# EAGLE design ads-b (EAGLE 7.5.0)
PROJECT_NAME: ADS-B Receiver; REVISION: 0.1

## Sheet 1 of 2
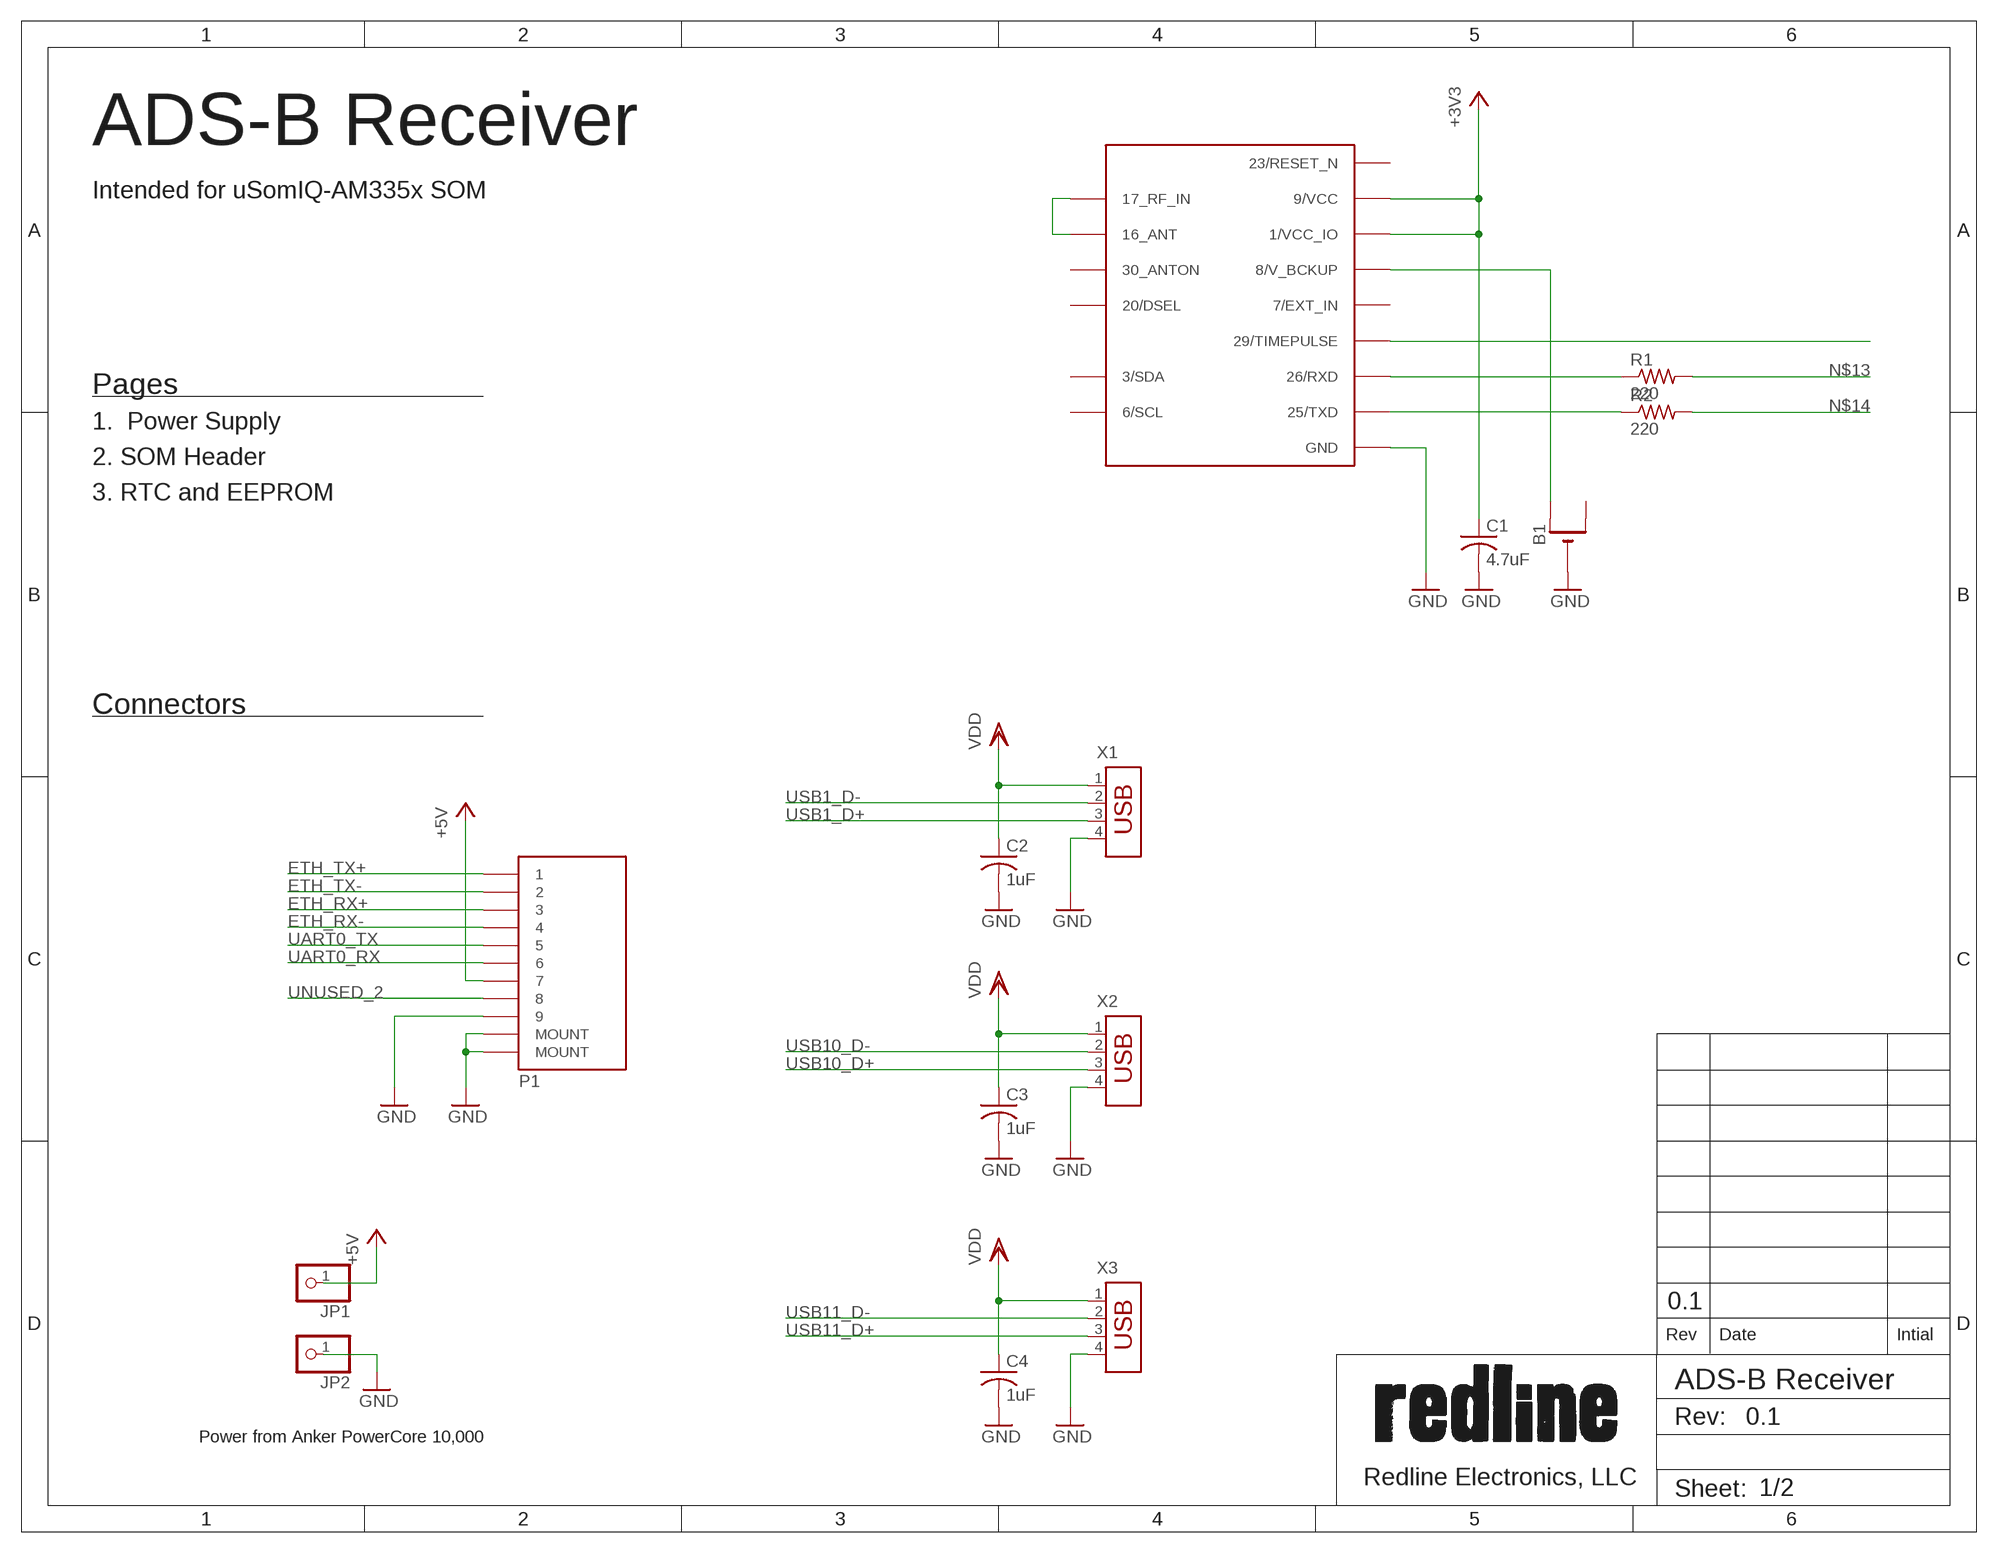
[diagram p0: schematic, sheet 1]

### Parts
B1  CR1220THM  [CR1220-THM]
C1  4.7uF  C-USC0603  [C0603]
C2  1uF  C-USC0603  [C0603]
C3  1uF  C-USC0603  [C0603]
C4  1uF  C-USC0603  [C0603]
JP1  PINHD-1X1  [1X01]
JP2  PINHD-1X1  [1X01]
P1  83611-9006  [83611-9006]
R1  220  R-US_R0603  [R0603]
R2  220  R-US_R0603  [R0603]
U$1  UBLOX_CAM  [UBLOX_CAM]
X1  USB-787616  [USB]
X2  USB-787616  [USB]
X3  USB-787616  [USB]

### Nets
+3V3: C1.1 U$1.1/VCC_IO U$1.9/VCC ; also sheet 2
+5V: JP1.1 P1.7 ; also sheet 2
ETH_RX+: P1.3 ; also sheet 2
ETH_RX-: P1.4 ; also sheet 2
ETH_TX+: P1.1 ; also sheet 2
ETH_TX-: P1.2 ; also sheet 2
GND: B1.- C1.2 C2.2 C3.2 C4.2 JP2.1 P1.9 P1.MOUNT@1(MOUNT) P1.MOUNT@2(MOUNT) U$1.4/GND(GND) U$1.5/GND(GND) U$1.10/GND(GND) U$1.11/GND(GND) U$1.12/GND(GND) U$1.13/GND(GND) U$1.14/GND(GND) U$1.15/GND(GND) U$1.18/GND(GND) U$1.19/GND(GND) U$1.21/GND(GND) U$1.22/GND(GND) U$1.27/GND(GND) U$1.31/GND(GND) X1.4 X2.4 X3.4 ; also sheet 2
N$1: B1.+1(+) U$1.8/V_BCKP(8/V_BCKUP)
N$8: R1.1 U$1.26/RXD
N$12: R2.1 U$1.25/TXD
N$13: R1.2
N$14: R2.2
N$15: U$1.29/TIMEPULSE
N$26: U$1.16/ANT(16_ANT) U$1.17/RF_IN(17_RF_IN)
UART0_RX: P1.6 ; also sheet 2
UART0_TX: P1.5 ; also sheet 2
UNUSED_2: P1.8
USB1_D+: X1.3 ; also sheet 2
USB1_D-: X1.2 ; also sheet 2
USB10_D+: X2.3 ; also sheet 2
USB10_D-: X2.2 ; also sheet 2
USB11_D+: X3.3 ; also sheet 2
USB11_D-: X3.2 ; also sheet 2
VDD: C2.1 C3.1 C4.1 X1.1 X2.1 X3.1 ; also sheet 2
Unconnected: B1.+2(+1) U$1.3/SDA U$1.6/SCL U$1.7/EXINT(7/EXT_IN) U$1.20/DSEL U$1.30/ANTON(30_ANTON)

### Notes on the sheet
- ADS-B Receiver
- Intended for uSomIQ-AM335x SOM
- Pages
- 1.  Power Supply
- 2. SOM Header
- 3. RTC and EEPROM
- Connectors
- 0.1
- Power from Anker PowerCore 10,000

## Sheet 2 of 2
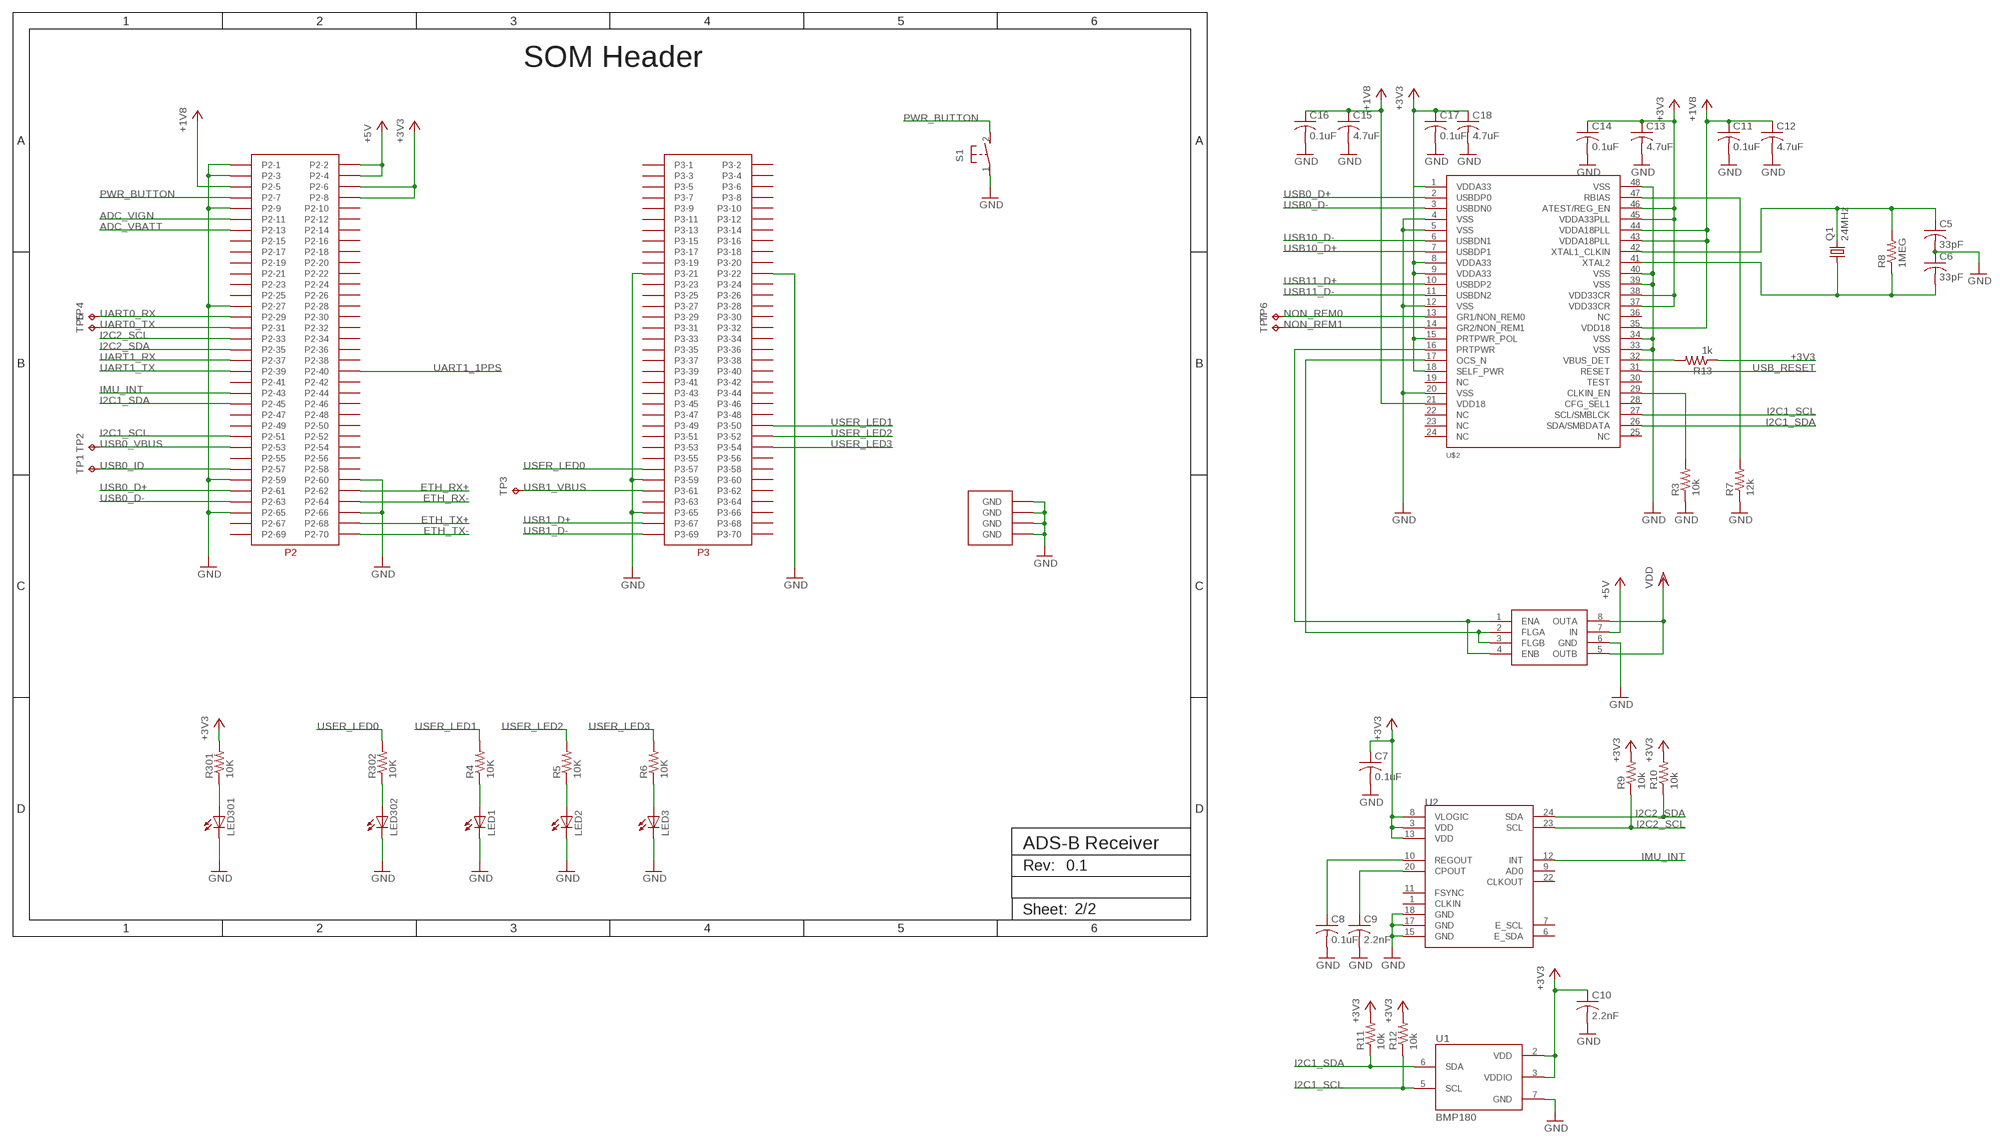
[diagram p1: schematic, sheet 2]

### Parts
C5  33pF  C-USC0603  [C0603]
C6  33pF  C-USC0603  [C0603]
C7  0.1uF  C-USC0603  [C0603]
C8  0.1uF  C-USC0603  [C0603]
C9  2.2nF  C-USC0603  [C0603]
C10  2.2nF  C-USC0603  [C0603]
C11  0.1uF  C-USC0603  [C0603]
C12  4.7uF  C-USC0603  [C0603]
C13  4.7uF  C-USC0603  [C0603]
C14  0.1uF  C-USC0603  [C0603]
C15  4.7uF  C-USC0603  [C0603]
C16  0.1uF  C-USC0603  [C0603]
C17  0.1uF  C-USC0603  [C0603]
C18  4.7uF  C-USC0603  [C0603]
LED1  LEDSML0603  [SML0603]
LED2  LEDSML0603  [SML0603]
LED3  LEDSML0603  [SML0603]
LED301  LEDSML0603  [SML0603]
LED302  LEDSML0603  [SML0603]
P301  USOMIQ-AM335X  [USOMIQ-AM335X]
Q1  24MHz  CRYSTALHC49S  [HC49/S]
R3  10k  R-US_R0603  [R0603]
R4  10K  R-US_R0603  [R0603]
R5  10K  R-US_R0603  [R0603]
R6  10K  R-US_R0603  [R0603]
R7  12k  R-US_R0603  [R0603]
R8  1MEG  R-US_R0603  [R0603]
R9  10k  R-US_R0603  [R0603]
R10  10k  R-US_R0603  [R0603]
R11  10k  R-US_R0603  [R0603]
R12  10k  R-US_R0603  [R0603]
R13  1k  R-US_R0603  [R0603]
R301  10K  R-US_R0603  [R0603]
R302  10K  R-US_R0603  [R0603]
S1  31-XX  [B3F-31XX]
TP1  TPB1,27  [B1,27]
TP2  TPB1,27  [B1,27]
TP3  TPB1,27  [B1,27]
TP4  TPB1,27  [B1,27]
TP5  TPB1,27  [B1,27]
TP6  TPB1,27  [B1,27]
TP7  TPB1,27  [B1,27]
U1  BMP180  [BMP180]
U2  MPU-9150QFN-24-NP  [QFN-24-NP]
U$2  USB2502  [S-PQFP-G48]
U$3  MIC2026  [SO8]

### Nets
+3V3: C7.1 C10.1 C11.1 C12.1 C13.1 C14.1 C15.1 C16.1 C17.1 C18.1 P301.P$5(P2-5) P301.P$6(P2-6) P301.P$8(P2-8) R9.2 R10.2 R11.2 R12.2 R13.1 R301.2 U1.2(VDD) U1.3(VDDIO) U2.3(VDD) U2.8(VLOGIC) U2.13(VDD) U$2.1(VDDA33) U$2.8(VDDA33) U$2.9(VDDA33) U$2.15(PRTPWR_POL) U$2.18(SELF_PWR) U$2.21(VDD18) U$2.35(VDD18) U$2.37(VDD33CR) U$2.38(VDD33CR) U$2.43(VDDA18PLL) U$2.44(VDDA18PLL) U$2.45(VDDA33PLL) U$2.46(ATEST/REG_EN) ; supply symbol labelled +1V8 ; also sheet 1
+5V: P301.P$2(P2-2) P301.P$4(P2-4) U$3.7(IN) ; also sheet 1
ADC_VBATT: P301.P$13(P2-13)
ADC_VIGN: P301.P$11(P2-11)
ETH_RX+: P301.P$62(P2-62) ; also sheet 1
ETH_RX-: P301.P$64(P2-64) ; also sheet 1
ETH_TX+: P301.P$68(P2-68) ; also sheet 1
ETH_TX-: P301.P$70(P2-70) ; also sheet 1
GND: C5.2 C6.1 C7.2 C8.2 C9.2 C10.2 C11.2 C12.2 C13.2 C14.2 C15.2 C16.2 C17.2 C18.2 LED1.C LED2.C LED3.C LED301.C LED302.C P301.MOUNT@0(GND) P301.MOUNT@1(GND) P301.MOUNT@2(GND) P301.MOUNT@3(GND) P301.P$1(P2-1) P301.P$3(P2-3) P301.P$9(P2-9) P301.P$27(P2-27) P301.P$59(P2-59) P301.P$60(P2-60) P301.P$65(P2-65) P301.P$66(P2-66) P301.P$91(P3-21) P301.P$92(P3-22) P301.P$129(P3-59) P301.P$135(P3-65) R3.1 R7.1 S1.1(P) U1.7(GND) U2.15(GND) U2.17(GND) U2.18(GND) U$2.4(VSS) U$2.5(VSS) U$2.12(VSS) U$2.20(VSS) U$2.33(VSS) U$2.34(VSS) U$2.39(VSS) U$2.40(VSS) U$2.48(VSS) U$3.6(GND) ; also sheet 1
I2C1_SCL: P301.P$51(P2-51) R12.1 U1.5(SCL) U$2.27(SCL/SMBLCK)
I2C1_SDA: P301.P$45(P2-45) R11.1 U1.6(SDA) U$2.26(SDA/SMBDATA)
I2C2_SCL: P301.P$33(P2-33) R9.1 U2.23(SCL)
I2C2_SDA: P301.P$35(P2-35) R10.1 U2.24(SDA)
IMU_INT: P301.P$43(P2-43) U2.12(INT)
N$2: R3.2 U$2.29(CLKIN_EN)
N$3: U$2.16(PRTPWR) U$3.1(ENA) U$3.4(ENB)
N$4: R7.2 U$2.47(RBIAS)
N$5: C5.1 Q1.2 R8.2 U$2.42(XTAL1_CLKIN)
N$6: C6.2 Q1.1 R8.1 U$2.41(XTAL2)
N$7: C8.1 U2.10(REGOUT)
N$9: C9.1 U2.20(CPOUT)
N$10: U$2.17(OCS_N) U$3.2(FLGA) U$3.3(FLGB)
N$11: R13.2 U$2.32(VBUS_DET)
NON_REM0: TP6.TP U$2.13(GR1/NON_REM0)
NON_REM1: TP7.TP U$2.14(GR2/NON_REM1)
PWR_BUTTON: P301.P$7(P2-7) S1.2(S)
UART0_RX: P301.P$29(P2-29) TP4.TP ; also sheet 1
UART0_TX: P301.P$31(P2-31) TP5.TP ; also sheet 1
UART1_1PPS: P301.P$40(P2-40)
UART1_RX: P301.P$37(P2-37)
UART1_TX: P301.P$39(P2-39)
USB0_D+: P301.P$61(P2-61) U$2.2(USBDP0)
USB0_D-: P301.P$63(P2-63) U$2.3(USBDN0)
USB0_ID: P301.P$57(P2-57) TP1.TP
USB0_VBUS: P301.P$53(P2-53) TP2.TP
USB1_D+: P301.P$137(P3-67) ; also sheet 1
USB1_D-: P301.P$139(P3-69) ; also sheet 1
USB1_VBUS: P301.P$131(P3-61) TP3.TP
USB10_D+: U$2.7(USBDP1) ; also sheet 1
USB10_D-: U$2.6(USBDN1) ; also sheet 1
USB11_D+: U$2.10(USBDP2) ; also sheet 1
USB11_D-: U$2.11(USBDN2) ; also sheet 1
USB_RESET: U$2.31(RESET)
USER_LED0: P301.P$127(P3-57) R302.2
USER_LED1: P301.P$120(P3-50) R4.2
USER_LED2: P301.P$122(P3-52) R5.2
USER_LED3: P301.P$124(P3-54) R6.2
VDD: U$3.5(OUTB) U$3.8(OUTA) ; also sheet 1
VDD_PGOOD1: LED301.A R301.1
VDD_PGOOD2: LED302.A R302.1
VDD_PGOOD3: LED1.A R4.1
VDD_PGOOD4: LED2.A R5.1
VDD_PGOOD5: LED3.A R6.1
Unconnected: P301.P$10(P2-10) P301.P$12(P2-12) P301.P$14(P2-14) P301.P$15(P2-15) P301.P$16(P2-16) P301.P$17(P2-17) P301.P$18(P2-18) P301.P$19(P2-19) P301.P$20(P2-20) P301.P$21(P2-21) P301.P$22(P2-22) P301.P$23(P2-23) P301.P$24(P2-24) P301.P$25(P2-25) P301.P$26(P2-26) P301.P$28(P2-28) P301.P$30(P2-30) P301.P$32(P2-32) P301.P$34(P2-34) P301.P$36(P2-36) P301.P$38(P2-38) P301.P$41(P2-41) P301.P$42(P2-42) P301.P$44(P2-44) P301.P$46(P2-46) P301.P$47(P2-47) P301.P$48(P2-48) P301.P$49(P2-49) P301.P$50(P2-50) P301.P$52(P2-52) P301.P$54(P2-54) P301.P$55(P2-55) P301.P$56(P2-56) P301.P$58(P2-58) P301.P$67(P2-67) P301.P$69(P2-69) P301.P$71(P3-1) P301.P$72(P3-2) P301.P$73(P3-3) P301.P$74(P3-4) P301.P$75(P3-5) P301.P$76(P3-6) P301.P$77(P3-7) P301.P$78(P3-8) P301.P$79(P3-9) P301.P$80(P3-10) P301.P$81(P3-11) P301.P$82(P3-12) P301.P$83(P3-13) P301.P$84(P3-14) P301.P$85(P3-15) P301.P$86(P3-16) P301.P$87(P3-17) P301.P$88(P3-18) P301.P$89(P3-19) P301.P$90(P3-20) P301.P$93(P3-23) P301.P$94(P3-24) P301.P$95(P3-25) P301.P$96(P3-26) P301.P$97(P3-27) P301.P$98(P3-28) P301.P$99(P3-29) P301.P$100(P3-30) P301.P$101(P3-31) P301.P$102(P3-32) P301.P$103(P3-33) P301.P$104(P3-34) P301.P$105(P3-35) P301.P$106(P3-36) P301.P$107(P3-37) P301.P$108(P3-38) P301.P$109(P3-39) P301.P$110(P3-40) P301.P$111(P3-41) P301.P$112(P3-42) P301.P$113(P3-43) P301.P$114(P3-44) P301.P$115(P3-45) P301.P$116(P3-46) P301.P$117(P3-47) P301.P$118(P3-48) P301.P$119(P3-49) P301.P$121(P3-51) P301.P$123(P3-53) P301.P$125(P3-55) P301.P$126(P3-56) P301.P$128(P3-58) P301.P$130(P3-60) P301.P$132(P3-62) P301.P$133(P3-63) P301.P$134(P3-64) P301.P$136(P3-66) P301.P$138(P3-68) P301.P$140(P3-70) U2.1(CLKIN) U2.6(E_SDA) U2.7(E_SCL) U2.9(AD0) U2.11(FSYNC) U2.22(CLKOUT) U$2.19(NC) U$2.22(NC) U$2.23(NC) U$2.24(NC) U$2.25(NC) U$2.28(CFG_SEL1) U$2.30(TEST) U$2.36(NC)

### Notes on the sheet
- SOM Header

## Power pins joined to a net without a drawn wire
23/RESET_N: U$1.23/RESET_N

## Library data of the parts
B1 = adafruit:CR1220: CR1216/CR1220/CR1225 12mm 3V lithium coin cell Great for battery packup. Both SMT and THM holders. Note the THM package has the ground pads on both sides of the PCB so that the masks are the same - this reduces the cost
C1-C18 = rcl:C-US: CAPACITOR, American symbol
JP1 JP2 = adafruit:PINHD-1X1: Pin header 1x1 for 0.1" spacing With round pins
LED1-LED3 LED301 LED302 = led:LED: LED OSRAM: - CHIPLED LG R971, LG N971, LY N971, LG Q971, LY Q971, LO R971, LY R971 LH N974, LH R974 LS Q976, LO Q976, LY Q976 LO Q996 - Hyper CHIPLED LW Q18S LB Q993, LB Q99A, LB R99A - SideLED LS A670, LO A670, LY A670, LG A670, LP A670 LB A673, LV A673, LT A673, LW A673 LH A674 LY A675 LS A676, LA A676, LO A676, LY A676, LW A676 LS A679, LY A679, LG A679 - Hyper Micro SIDELED® LS Y876, LA Y876, LO Y876, LY Y876 LT Y87S - SmartLED LW L88C, LW L88S LB L89C, LB L89S, LG L890 LS L89K, LO L89K, LY L89K LS L896, LA L896, LO L896, LY L896 - TOPLED LS T670, LO T670, LY T670, LG T670, LP T670 LSG T670, LSP T670, LSY T670, LOP T670, LYG T670 LG T671, LOG T671, LSG T671 LB T673, LV T673, LT T673, LW T673 LH T674 LS T676, LA T676, LO T676, LY T676, LB T676, LH T676, LSB T676, LW T676 LB T67C, LV T67C, LT T67C, LS T67K, LO T67K, LY T67K, LW E67C LS E67B, LA E67B, LO E67B, LY E67B, LB E67C, LV E67C, LT E67C LW T67C LS T679, LY T679, LG T679 LS T770, LO T770, LY T770, LG T770, LP T770 LB T773, LV T773, LT T773, LW T773 LH T774 LS E675, LA E675, LY E675, LS T675 LS T776, LA T776, LO T776, LY T776, LB T776 LHGB T686 LT T68C, LB T68C - Hyper Mini TOPLED® LB M676 - Mini TOPLED Santana® LG M470 LS M47K, LO M47K, LY M47K Source: http://www.osram.convergy.de LUXEON: - LUMILED® LXK2-PW12-R00, LXK2-PW12-S00, LXK2-PW14-U00, LXK2-PW14-V00 LXK2-PM12-R00, LXK2-PM12-S00, LXK2-PM14-U00 LXK2-PE12-Q00, LXK2-PE12-R00, LXK2-PE12-S00, LXK2-PE14-T00, LXK2-PE14-U00 LXK2-PB12-K00, LXK2-PB12-L00, LXK2-PB12-M00, LXK2-PB14-N00, LXK2-PB14-P00, LXK2-PB14-Q00 LXK2-PR12-L00, LXK2-PR12-M00, LXK2-PR14-Q00, LXK2-PR14-R00 LXK2-PD12-Q00, LXK2-PD12-R00, LXK2-PD12-S00 LXK2-PH12-R00, LXK2-PH12-S00 LXK2-PL12-P00, LXK2-PL12-Q00, LXK2-PL12-R00 Source: www.luxeon.com KINGBRIGHT: KA-3528ASYC Source: www.kingbright.com
P1 = connectors:83611-9006
P301 = connectors:USOMIQ-AM335X
Q1 = adafruit:CRYSTAL: CRYSTAL; OC_FARNELL: 1667008; OC_NEWARK: unknown
R1-R13 R301 R302 = rcl:R-US_: RESISTOR, American symbol
S1 = adafruit:31-XX: OMRON SWITCH Now with beefier pads!
TP1-TP7 = testpad:TP: Test pad
U1 = SparkFun-Sensors:BMP180: BOSCH BMP180 DIGITAL BAROMETRIC PRESSURE SENSOR Web page: http://www.bosch-sensortec.com/en/homepage/products_3/environmental_sensors_1/bmp180_1/bmp180 Datasheet: http://ae-bst.resource.bosch.com/media/products/dokumente/bmp180/BST-BMP180-DS000-09.pdf The BMP180 is the function compatible successor of the BMP085, a new generation of high precision digital pressure sensors for consumer applications. The ultra-low power, low voltage electronics of the BMP180 is optimized for use in mobile phones, PDAs, GPS navigation devices and outdoor equipment. With a low altitude noise of merely 0.25m at fast conversion time, the BMP180 offers superior performance. The I2C interface allows for easy system integration with a microcontroller. The BMP180 is based on piezo-resistive technology for EMC robustness, high accuracy and linearity as well as long term stability. Key features: - Temperature measurement included - I2C interface - Fully calibrated - Pb-free, halogen-free and RoHS compliant, - MSL 1 Basic specs: Pressure range: 300 to 1100hPa (+9000m to -500m relating to sea level) Supply voltage: 1.8 to 3.6V (VDD), 1.62V to 3.6V (VDDIO) Package: LGA package with metal lid Small footprint: 3.6mm x 3.8mm Super-flat: 0.93mm height Low power: 5μA at 1 sample / sec. in standard mode Low noise: 0.06hPa (0.5m) in ultra low power mode, 0.02hPa (0.17m) advanced resolution mode Typical applications: - Enhancement of GPS navigation (dead-reckoning, slope detection, etc.) - In- and out-door navigation - Leisure and sports - Weather forecast - Vertical velocity indication (rise/sink speed)
U2 = SparkFun-Sensors:MPU-9150: 9DOF (3mag, 3accel, 3rotat). I2C interface.
U$1 = ubloxLib:UBLOX_CAM: u-blox CAM GNSS antenna module
U$2 = misc-ics:USB2502
U$3 = misc-ics:MIC2026
X1-X3 = con-amp:USB-787616: AMP connector

## Board
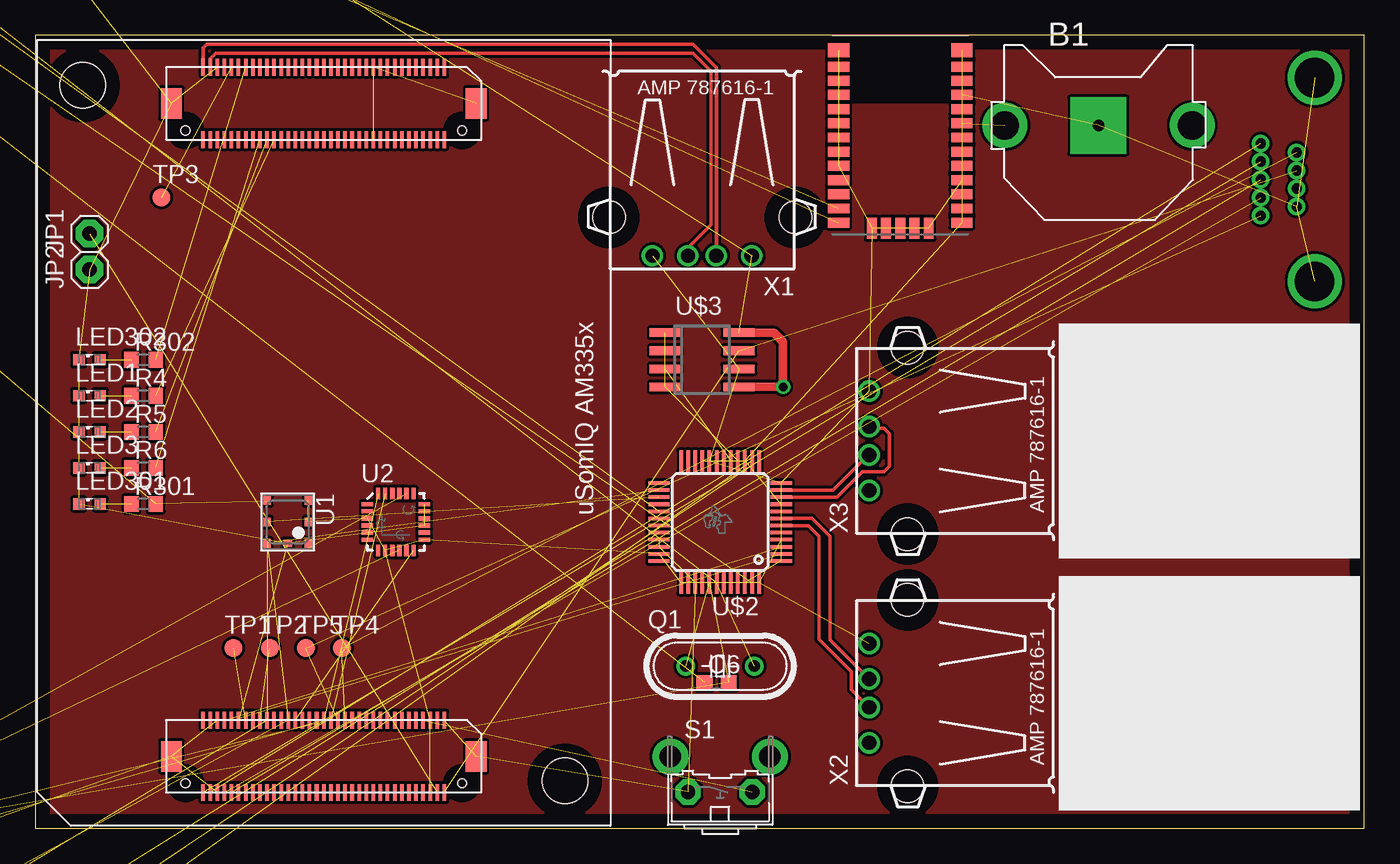
[diagram p2: board, top side]
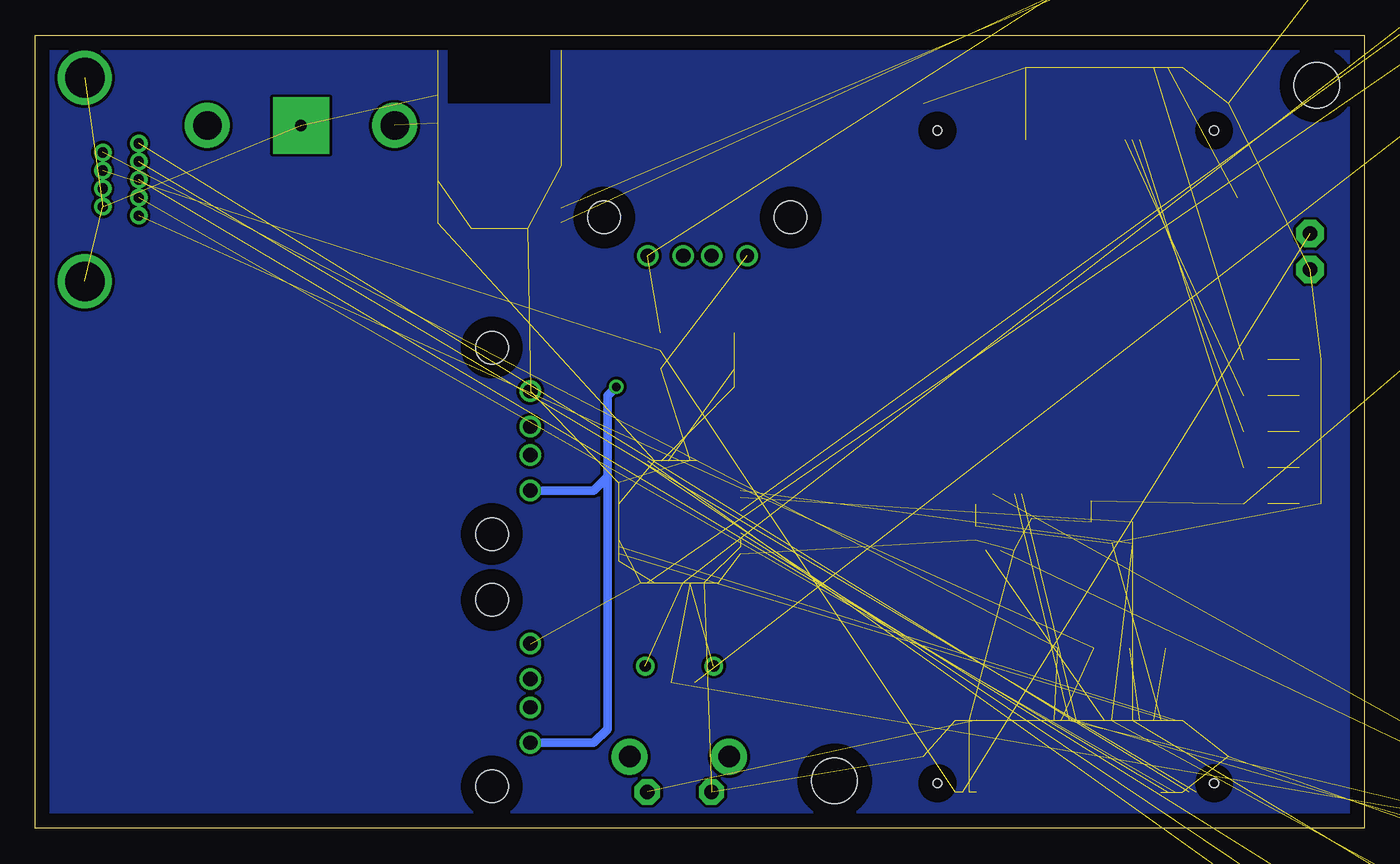
[diagram p3: board, bottom side, seen from below]

Size 93.65 x 55.87 mm. Coordinates in mm from the lower left corner, seen from the top.
Outline: 0,0 93.65,0 93.65,55.87 0,55.87 0,0
Copper layers (1*16): Top 0.035mm / dielectric 1.5mm / Bottom 0.035mm
Design rules "default": minimum track width 10mil, minimum drill 24mil, track to track 8mil, track to pad 8mil, pad to pad 8mil, via to via 8mil, smd to smd 8mil, copper to edge 40mil, drill to drill 8mil, minimum pad ring 10mil, minimum via ring 8mil, stop-mask expansion 4mil, vias tented up to drill 0mil, thermal gap 10mil

### Footprints (pad centres in the part's own frame; a part is rotated, then mirrored left to right if it is on the bottom)
CR1220-THM = drill 2 pad 3.175: +1 -6.604,0; +2 6.604,0 | drill 0.8 pad 3.962 square: - 0,0
C0603 = smd 1.1 x 1: 1 -0.85,0; 2 0.85,0
1X01 = drill 1.016 pad 1.93 octagon: 1 0,0
SML0603 = smd 0.8 x 0.8: A 0.75,0; C -0.75,0
83611-9006 = drill 0.711 pad 1.016: 1 0,0; 2 1.27,0; 3 2.54,0; 4 3.81,0; 5 5.08,0; 6 0.635,2.54; 7 1.905,2.54; 8 3.175,2.54; 9 4.445,2.54 | drill 2.794: MOUNT@1 -4.636,3.81; MOUNT@2 9.716,3.81
USOMIQ-AM335X = smd 2.15 x 1.475: MOUNT@0 0,-10.738; MOUNT@1 0,10.738; MOUNT@2 46,-10.738; MOUNT@3 46,10.738 | smd 1.188 x 0.25: P$1 2.55,-8.5; P$2 -2.55,-8.5; P$3 2.55,-8; P$4 -2.55,-8; P$5 2.55,-7.5; P$6 -2.55,-7.5; P$7 2.55,-7; P$8 -2.55,-7; P$9 2.55,-6.5; P$10 -2.55,-6.5; P$11 2.55,-6; P$12 -2.55,-6; P$13 2.55,-5.5; P$14 -2.55,-5.5; P$15 2.55,-5; P$16 -2.55,-5; P$17 2.55,-4.5; P$18 -2.55,-4.5; P$19 2.55,-4; P$20 -2.55,-4; P$21 2.55,-3.5; P$22 -2.55,-3.5; P$23 2.55,-3; P$24 -2.55,-3; P$25 2.55,-2.5; P$26 -2.55,-2.5; P$27 2.55,-2; P$28 -2.55,-2; P$29 2.55,-1.5; P$30 -2.55,-1.5; P$31 2.55,-1; P$32 -2.55,-1; P$33 2.55,-0.5; P$34 -2.55,-0.5; P$35 2.55,0; P$36 -2.55,0; P$37 2.55,0.5; P$38 -2.55,0.5; P$39 2.55,1; P$40 -2.55,1; P$41 2.55,1.5; P$42 -2.55,1.5; P$43 2.55,2; P$44 -2.55,2; P$45 2.55,2.5; P$46 -2.55,2.5; P$47 2.55,3; P$48 -2.55,3; P$49 2.55,3.5; P$50 -2.55,3.5; P$51 2.55,4; P$52 -2.55,4; P$53 2.55,4.5; P$54 -2.55,4.5; P$55 2.55,5; P$56 -2.55,5; P$57 2.55,5.5; P$58 -2.55,5.5; P$59 2.55,6; P$60 -2.55,6; P$61 2.55,6.5; P$62 -2.55,6.5; P$63 2.55,7; P$64 -2.55,7; P$65 2.55,7.5; P$66 -2.55,7.5; P$67 2.55,8; P$68 -2.55,8; P$69 2.55,8.5; P$70 -2.55,8.5; P$71 48.55,-8.5; P$72 43.45,-8.5; P$73 48.55,-8; P$74 43.45,-8; P$75 48.55,-7.5; P$76 43.45,-7.5; P$77 48.55,-7; P$78 43.45,-7; P$79 48.55,-6.5; P$80 43.45,-6.5; P$81 48.55,-6; P$82 43.45,-6; P$83 48.55,-5.5; P$84 43.45,-5.5; P$85 48.55,-5; P$86 43.45,-5; P$87 48.55,-4.5; P$88 43.45,-4.5; P$89 48.55,-4; P$90 43.45,-4; P$91 48.55,-3.5; P$92 43.45,-3.5; P$93 48.55,-3; P$94 43.45,-3; P$95 48.55,-2.5; P$96 43.45,-2.5; P$97 48.55,-2; P$98 43.45,-2; P$99 48.55,-1.5; P$100 43.45,-1.5; P$101 48.55,-1; P$102 43.45,-1; P$103 48.55,-0.5; P$104 43.45,-0.5; P$105 48.55,0; P$106 43.45,0; P$107 48.55,0.5; P$108 43.45,0.5; P$109 48.55,1; P$110 43.45,1; P$111 48.55,1.5; P$112 43.45,1.5; P$113 48.55,2; P$114 43.45,2; P$115 48.55,2.5; P$116 43.45,2.5; P$117 48.55,3; P$118 43.45,3; P$119 48.55,3.5; P$120 43.45,3.5; P$121 48.55,4; P$122 43.45,4; P$123 48.55,4.5; P$124 43.45,4.5; P$125 48.55,5; P$126 43.45,5; P$127 48.55,5.5; P$128 43.45,5.5; P$129 48.55,6; P$130 43.45,6; P$131 48.55,6.5; P$132 43.45,6.5; P$133 48.55,7; P$134 43.45,7; P$135 48.55,7.5; P$136 43.45,7.5; P$137 48.55,8; P$138 43.45,8; P$139 48.55,8.5; P$140 43.45,8.5 | hole 0.625: -1.9,-9.75; -1.9,9.75; 44.1,-9.75; 44.1,9.75 | hole 3.2: -1.725,-17; 47.275,17
HC49/S = drill 0.813: 1 -2.413,0; 2 2.413,0
R0603 = smd 1 x 1.1: 1 -0.85,0; 2 0.85,0
B3F-31XX = drill 1.016 pad 1.778 octagon: 1 -2.261,-1.245; 2 2.261,-1.245 | drill 1.499 pad 2.54: 3 -3.505,1.245; 4 3.505,1.245
B1,27 = smd 1.27 x 1.27: TP 0,0
BMP180 = smd 0.6 x 0.5: 1 1.5,1.45; 2 0,1.45; 3 -1.5,1.45; 4 -1.5,-1.45; 5 0,-1.45; 6 1.5,-1.45 | smd 0.5 x 0.6: 7 1.5,0
QFN-24-NP = smd 0.8 x 0.3: 1 -2,1.25; 2 -2,0.75; 3 -2,0.25; 4 -2,-0.25; 5 -2,-0.75; 6 -2,-1.25; 13 2,-1.25; 14 2,-0.75; 15 2,-0.25; 16 2,0.25; 17 2,0.75; 18 2,1.25 | smd 0.3 x 0.8: 7 -1.25,-2; 8 -0.75,-2; 9 -0.25,-2; 10 0.25,-2; 11 0.75,-2; 12 1.25,-2; 19 1.25,2; 20 0.75,2; 21 0.25,2; 22 -0.25,2; 23 -0.75,2; 24 -1.25,2
UBLOX_CAM = smd 0.7 x 1.5: 1/VCC_IO -13.2,-4.35; 2/RES -12.2,-4.35; 3/SDA -11.2,-4.35; 4/GND -10.2,-4.35; 5/GND -9.2,-4.35; 6/SCL -8.2,-4.35; 7/EXINT -7.2,-4.35; 8/V_BCKP -6.2,-4.35; 9/VCC -5.2,-4.35; 10/GND -4.2,-4.35; 11/GND -3.2,-4.35; 12/GND -2.2,-4.35; 15/GND -2.2,4.35; 16/ANT -3.2,4.35; 17/RF_IN -4.2,4.35; 18/GND -5.2,4.35; 19/GND -6.2,4.35; 20/DSEL -7.2,4.35; 21/GND -8.2,4.35; 22/GND -9.2,4.35; 23/RESET_N -10.2,4.35; 24/RES -11.2,4.35; 25/TXD -12.2,4.35; 26/RXD -13.2,4.35 | smd 1 x 1.5: 13/GND -1.05,-4.35; 14/GND -1.05,4.35 | smd 1.5 x 0.7: 27/GND -13.6,2; 28/RES -13.6,1; 29/TIMEPULSE -13.6,0; 30/ANTON -13.6,-1; 31/GND -13.6,-2
S-PQFP-G48 = smd 1.5 x 0.25: 1 -4.3,2.75; 2 -4.3,2.25; 3 -4.3,1.75; 4 -4.3,1.25; 5 -4.3,0.75; 6 -4.3,0.25; 7 -4.3,-0.25; 8 -4.3,-0.75; 9 -4.3,-1.25; 10 -4.3,-1.75; 11 -4.3,-2.25; 12 -4.3,-2.75; 25 4.3,-2.75; 26 4.3,-2.25; 27 4.3,-1.75; 28 4.3,-1.25; 29 4.3,-0.75; 30 4.3,-0.25; 31 4.3,0.25; 32 4.3,0.75; 33 4.3,1.25; 34 4.3,1.75; 35 4.3,2.25; 36 4.3,2.75 | smd 0.25 x 1.5: 13 -2.75,-4.3; 14 -2.25,-4.3; 15 -1.75,-4.3; 16 -1.25,-4.3; 17 -0.75,-4.3; 18 -0.25,-4.3; 19 0.25,-4.3; 20 0.75,-4.3; 21 1.25,-4.3; 22 1.75,-4.3; 23 2.25,-4.3; 24 2.75,-4.3; 37 2.75,4.3; 38 2.25,4.3; 39 1.75,4.3; 40 1.25,4.3; 41 0.75,4.3; 42 0.25,4.3; 43 -0.25,4.3; 44 -0.75,4.3; 45 -1.25,4.3; 46 -1.75,4.3; 47 -2.25,4.3; 48 -2.75,4.3
SO8 = smd 0.6 x 2.2: 1 -1.905,-2.6; 2 -0.635,-2.6; 3 0.635,-2.6; 4 1.905,-2.6; 5 1.905,2.6; 6 0.635,2.6; 7 -0.635,2.6; 8 -1.905,2.6
USB = drill 1: 1 -3.5,12.99; 2 -1,12.99; 3 1,12.99; 4 3.5,12.99 | hole 2.3: -6.57,10.28; 6.57,10.28

### Placement (x,y rotation side)
B1  74.93,49.53 0 top
C1  -53.34,76.2 0 top  (outside the outline)
C2  -16.51,83.82 0 top  (outside the outline)
C3  -21.59,83.82 0 top  (outside the outline)
C4  -26.67,83.82 0 top  (outside the outline)
C5  -41.91,87.63 0 top  (outside the outline)
C6  48.01,10.29 0 top
C7  -83.82,-27.94 0 top  (outside the outline)
C8  -83.82,-33.02 0 top  (outside the outline)
C9  -83.82,-38.1 0 top  (outside the outline)
C10  -83.82,-43.18 0 top  (outside the outline)
C11  -83.82,-73.66 0 top  (outside the outline)
C12  -83.82,-78.74 0 top  (outside the outline)
C13  -83.82,-83.82 0 top  (outside the outline)
C14  -83.82,-88.9 0 top  (outside the outline)
C15  -83.82,-93.98 0 top  (outside the outline)
C16  -83.82,-99.06 0 top  (outside the outline)
C17  -83.82,-104.14 0 top  (outside the outline)
C18  -83.82,-109.22 0 top  (outside the outline)
JP1  3.81,41.91 90 top
JP2  3.81,39.37 90 top
LED1  3.81,30.48 0 top
LED2  3.81,27.94 0 top
LED3  3.81,25.4 0 top
LED301  3.81,22.86 0 top
LED302  3.81,33.02 0 top
P1  86.36,48.26 270 top
P301  20.32,5.08 90 top
Q1  48.26,11.43 0 top
R1  -31.75,83.82 0 top  (outside the outline)
R2  -36.83,83.82 0 top  (outside the outline)
R3  -41.91,83.82 0 top  (outside the outline)
R4  7.62,30.48 0 top
R5  7.62,27.94 0 top
R6  7.62,25.4 0 top
R7  -46.99,83.82 0 top  (outside the outline)
R8  -83.82,-12.7 0 top  (outside the outline)
R9  -83.82,-17.78 0 top  (outside the outline)
R10  -83.82,-22.86 0 top  (outside the outline)
R11  -83.82,-48.26 0 top  (outside the outline)
R12  -83.82,-53.34 0 top  (outside the outline)
R13  -83.82,-58.42 0 top  (outside the outline)
R301  7.62,22.86 0 top
R302  7.62,33.02 0 top
S1  48.26,3.81 0 top
TP1  13.97,12.7 0 top
TP2  16.51,12.7 0 top
TP3  8.89,44.45 0 top
TP4  21.59,12.7 0 top
TP5  19.05,12.7 0 top
TP6  -83.82,-64.77 0 top  (outside the outline)
TP7  -83.82,-69.85 0 top  (outside the outline)
U1  17.78,21.59 270 top
U2  25.4,21.59 0 top
U$1  60.96,55.88 90 top
U$2  48.26,21.59 180 top
U$3  46.99,33.02 270 top
X1  46.99,53.34 180 top
X2  71.75,9.53 90 top
X3  71.75,27.3 90 top

### Tracks (layer width: path | path; a pad name or v marks a point on that pad's centre or on a via)
+3V3  (39 unrouted)
+5V  (4 unrouted)
ETH_RX+  (1 unrouted)
ETH_RX-  (1 unrouted)
ETH_TX+  (1 unrouted)
ETH_TX-  (1 unrouted)
GND  (77 unrouted)
I2C1_SCL  (3 unrouted)
I2C1_SDA  (3 unrouted)
I2C2_SCL  (2 unrouted)
I2C2_SDA  (2 unrouted)
IMU_INT  (1 unrouted)
N$1  (1 unrouted)
N$2  (1 unrouted)
N$3  (2 unrouted)
N$4  (1 unrouted)
N$5  (3 unrouted)
N$6  (3 unrouted)
N$7  (1 unrouted)
N$8  (1 unrouted)
N$9  (1 unrouted)
N$10  (2 unrouted)
N$11  (1 unrouted)
N$12  (1 unrouted)
N$16
  pour Top: 0,55.88 93.98,55.88 93.98,0 0,0
N$17
  pour Bottom: 0,55.88 93.98,55.88 93.98,0 0,0
N$26  (1 unrouted)
NON_REM0  (1 unrouted)
NON_REM1  (1 unrouted)
PWR_BUTTON  (1 unrouted)
UART0_RX  (2 unrouted)
UART0_TX  (2 unrouted)
USB0_D+  (1 unrouted)
USB0_D-  (1 unrouted)
USB0_ID  (1 unrouted)
USB0_VBUS  (1 unrouted)
USB1_D+
  Top 0.254: X1.3 45.99,40.91 47.62,42.55 47.62,53.34 46.67,54.29 46.35,54.61 12.7,54.61 12.32,54.23 P301.P$137
USB1_D-
  Top 0.254: X1.2 47.99,53.61 46.35,55.24 12.06,55.24 11.82,55 P301.P$139
USB1_VBUS  (1 unrouted)
USB10_D+
  Top 0.254: U$2.7 54.74,21.84 56.01,20.57 56.01,13.28 X2.3
USB10_D-
  Top 0.254: U$2.6 54.48,21.34 55.24,20.57 55.24,13.34 57.53,11.05 57.53,9.76 X2.2
USB11_D+
  Top 0.254: U$2.10 56.49,23.34 58.29,25.15 59.82,25.15 60.2,25.53 60.2,27.81 59.82,28.19 58.88,28.19 X3.3
USB11_D-
  Top 0.254: U$2.11 56.23,23.84 57.15,24.77 57.53,25.15 58.69,26.3 X3.2
USER_LED0  (1 unrouted)
USER_LED1  (1 unrouted)
USER_LED2  (1 unrouted)
USER_LED3  (1 unrouted)
VDD  (via drill 0.6)  (4 unrouted)
  Top 0.61: U$3.5 v52.7,31.11 52.7,34.29 52.07,34.92 U$3.8
  Bottom 0.61: X2.1 54.3,6.03 53.34,6.99 53.34,24.77 | 53.34,24.77 53.34,30.48 v52.7,31.11 | X3.1 54.3,23.8 53.34,24.77
VDD_PGOOD1  (1 unrouted)
VDD_PGOOD2  (1 unrouted)
VDD_PGOOD3  (1 unrouted)
VDD_PGOOD4  (1 unrouted)
VDD_PGOOD5  (1 unrouted)